# EAGLE design control (EAGLE 6.4)
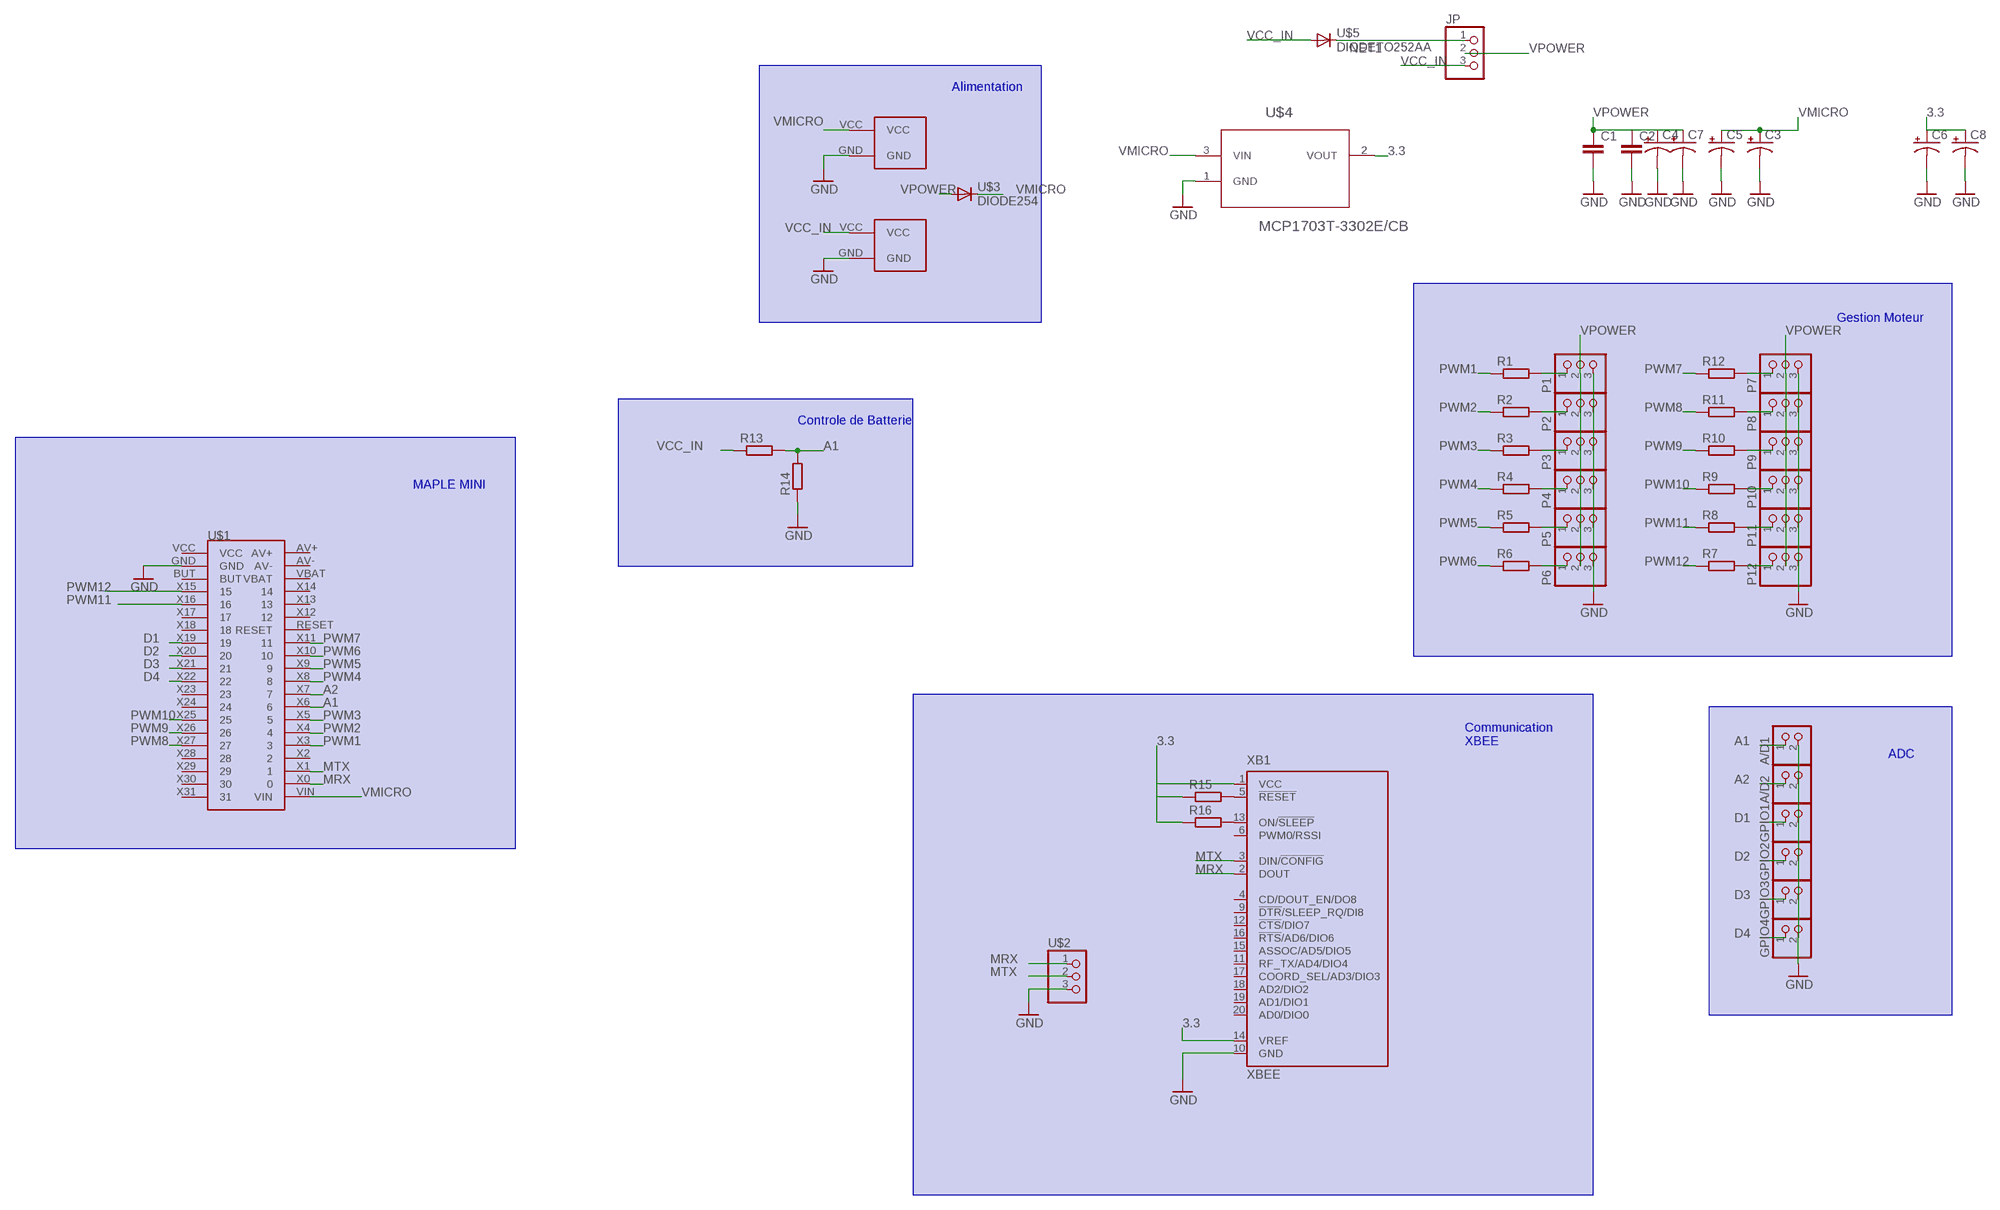
[diagram p0: schematic, sheet 1]

## Parts
A/D1  CONNEC_1X02  [CONNEC_1X02]
A/D2  CONNEC_1X02  [CONNEC_1X02]
C1  C-EU075-032X103  [C075-032X103]
C2  C-EU075-032X103  [C075-032X103]
C3  CAP_POLPTH2  [CPOL-RADIAL-10UF-25V]
C4  CAP_POLPTH2  [CPOL-RADIAL-10UF-25V]
C5  CAP_POLPTH2  [CPOL-RADIAL-10UF-25V]
C6  CAP_POLPTH2  [CPOL-RADIAL-10UF-25V]
C7  CAP_POLPTH2  [CPOL-RADIAL-10UF-25V]
C8  CAP_POLPTH2  [CPOL-RADIAL-10UF-25V]
GPIO1  CONNEC_1X02  [CONNEC_1X02]
GPIO2  CONNEC_1X02  [CONNEC_1X02]
GPIO3  CONNEC_1X02  [CONNEC_1X02]
GPIO4  CONNEC_1X02  [CONNEC_1X02]
JP  CONNEC_1X03  [CONNEC_1X03]
P1  CONNEC_1X03  [CONNEC_1X03]
P2  CONNEC_1X03  [CONNEC_1X03]
P3  CONNEC_1X03  [CONNEC_1X03]
P4  CONNEC_1X03  [CONNEC_1X03]
P5  CONNEC_1X03  [CONNEC_1X03]
P6  CONNEC_1X03  [CONNEC_1X03]
P7  CONNEC_1X03  [CONNEC_1X03]
P8  CONNEC_1X03  [CONNEC_1X03]
P9  CONNEC_1X03  [CONNEC_1X03]
P10  CONNEC_1X03  [CONNEC_1X03]
P11  CONNEC_1X03  [CONNEC_1X03]
P12  CONNEC_1X03  [CONNEC_1X03]
R1  RESISTANCE-R0805  [R0805]
R2  RESISTANCE-R0805  [R0805]
R3  RESISTANCE-R0805  [R0805]
R4  RESISTANCE-R0805  [R0805]
R5  RESISTANCE-R0805  [R0805]
R6  RESISTANCE-R0805  [R0805]
R7  RESISTANCE-R0805  [R0805]
R8  RESISTANCE-R0805  [R0805]
R9  RESISTANCE-R0805  [R0805]
R10  RESISTANCE-R0805  [R0805]
R11  RESISTANCE-R0805  [R0805]
R12  RESISTANCE-R0805  [R0805]
R13  R-EU_R0805  [R0805]
R14  R-EU_R0805  [R0805]
R15  R-EU_R0805  [R0805]
R16  R-EU_R0805  [R0805]
U$1  MAPLE_MINI  [CONNEC_2X20]
U$2  CONNEC_1X03  [CONNEC_1X03]
U$3  DIODE254  [DIODE_254]
U$4  MCP1703T-3302E/CB  [SOT95P300X145-3N]
U$5  DIODETO252AA  [TO-252AA]
U$10  JST_2  [JST_2]
U$11  JST_2  [JST_2]
XB1  XBEE  [XBEE]

## Nets
3.3: C6.1(+) C8.1(+) R15.1 R16.1 U$4.2(VOUT) XB1.1(VCC) XB1.14(VREF)
A1: A/D1.1 R13.2 R14.2 U$1.X6
A2: A/D2.1 U$1.X7
D1: GPIO1.1 U$1.X19
D2: GPIO2.1 U$1.X20
D3: GPIO3.1 U$1.X21
D4: GPIO4.1 U$1.X22
GND [alime]: A/D1.2 A/D2.2 C1.2 C2.2 C3.2(-) C4.2(-) C5.2(-) C6.2(-) C7.2(-) C8.2(-) GPIO1.2 GPIO2.2 GPIO3.2 GPIO4.2 P1.3 P2.3 P3.3 P4.3 P5.3 P6.3 P7.3 P8.3 P9.3 P10.3 P11.3 P12.3 R14.1 U$1.GND U$2.3 U$4.1(GND) U$10.GND U$11.GND XB1.10(GND)
MRX: U$1.X0 U$2.1 XB1.2(DOUT)
MTX: U$1.X1 U$2.2 XB1.3(DIN/!CONFIG)
N$1: P1.1 R1.2
N$2: P2.1 R2.2
N$3: P3.1 R3.2
N$4: P4.1 R4.2
N$5: P5.1 R5.2
N$6: P6.1 R6.2
N$7: P12.1 R7.2
N$8: P11.1 R8.2
N$9: P10.1 R9.2
N$10: P9.1 R10.2
N$11: P8.1 R11.2
N$12: P7.1 R12.2
N$13: R15.2 XB1.5(!RESET)
N$15: R16.2 XB1.13(ON/!SLEEP)
NET1: JP.1 U$5.4(C)
PWM1: R1.1 U$1.X3
PWM2: R2.1 U$1.X4
PWM3: R3.1 U$1.X5
PWM4: R4.1 U$1.X8
PWM5: R5.1 U$1.X9
PWM6: R6.1 U$1.X10
PWM7: R12.1 U$1.X11
PWM8: R11.1 U$1.X27
PWM9: R10.1 U$1.X26
PWM10: R9.1 U$1.X25
PWM11: R8.1 U$1.X16
PWM12: R7.1 U$1.X15
VCC_IN [alime]: JP.3 R13.1 U$5.3(A) U$11.VCC
VMICRO [alime]: C3.1(+) C5.1(+) U$1.VIN U$3.B(C) U$4.3(VIN) U$10.VCC
VPOWER [alime]: C1.1 C2.1 C4.1(+) C7.1(+) JP.2 P1.2 P2.2 P3.2 P4.2 P5.2 P6.2 P7.2 P8.2 P9.2 P10.2 P11.2 P12.2 U$3.A
Unconnected: U$1.AV+ U$1.AV- U$1.BUT U$1.RESET U$1.VBAT U$1.VCC U$1.X2 U$1.X12 U$1.X13 U$1.X14 U$1.X17 U$1.X18 U$1.X23 U$1.X24 U$1.X28 U$1.X29 U$1.X30 U$1.X31 XB1.4(CD/DOUT_EN/DO8) XB1.6(PWM0/RSSI) XB1.9(!DTR!/SLEEP_RQ/DI8) XB1.11(RF_TX/AD4/DIO4) XB1.12(!CTS!/DIO7) XB1.15(ASSOC/AD5/DIO5) XB1.16(!RTS!/AD6/DIO6) XB1.17(COORD_SEL/AD3/DIO3) XB1.18(AD2/DIO2) XB1.19(AD1/DIO1) XB1.20(AD0/DIO0)

## Notes on the sheet
- Alimentation
- Gestion Moteur
- Controle de Batterie
- MAPLE MINI
- Communication
  XBEE
- ADC

## Library data of the parts
A/D1 A/D2 GPIO1-GPIO4 = rhoban:CONNEC_1X02
C1 C2 = rcl:C-EU: CAPACITOR, European symbol
C3-C8 = SparkFun-Capacitors:CAP_POL: Capacitor Polarized These are standard SMD and PTH capacitors. Normally 10uF, 47uF, and 100uF in electrolytic and tantalum varieties. Always verify the external diameter of the through hole cap, it varies with capacity, voltage, and manufacturer. The EIA devices should be standard.
JP U$2 = RobotCampus:CONNEC_1X03
P1-P12 = rhoban:CONNEC_1X03
R1-R12 = rhoban:RESISTANCE: RESISTOR, European symbol
R13-R16 = rcl:R-EU_: RESISTOR, European symbol
U$1 = rhoban:MAPLE_MINI
U$3 = RobotCampus:DIODE254
U$4 = RobotCampus:MCP1703T-3302E/CB: Low Quiescent Current LDO Regulator; MPN: MCP1703T-3302E/CB; OC_FARNELL: 1439518; OC_NEWARK: 40M0637; PACKAGE: SOT-3; SUPPLIER: Microchip
U$5 = RobotCampus:DIODE
U$10 U$11 = RobotCampus:JST_2
XB1 = RobotCampus:XBEE: XBee (TM) /XBee-PRO(TM) OEM RF Modules Source: MaxStream, Inc. xbee_productmanual.pdf; MPN: XBP24-Z7UIT-004; OC_FARNELL: 1751799; OC_NEWARK: 34R5507

## Net classes
1 alime: width 1.016 mm

## Board
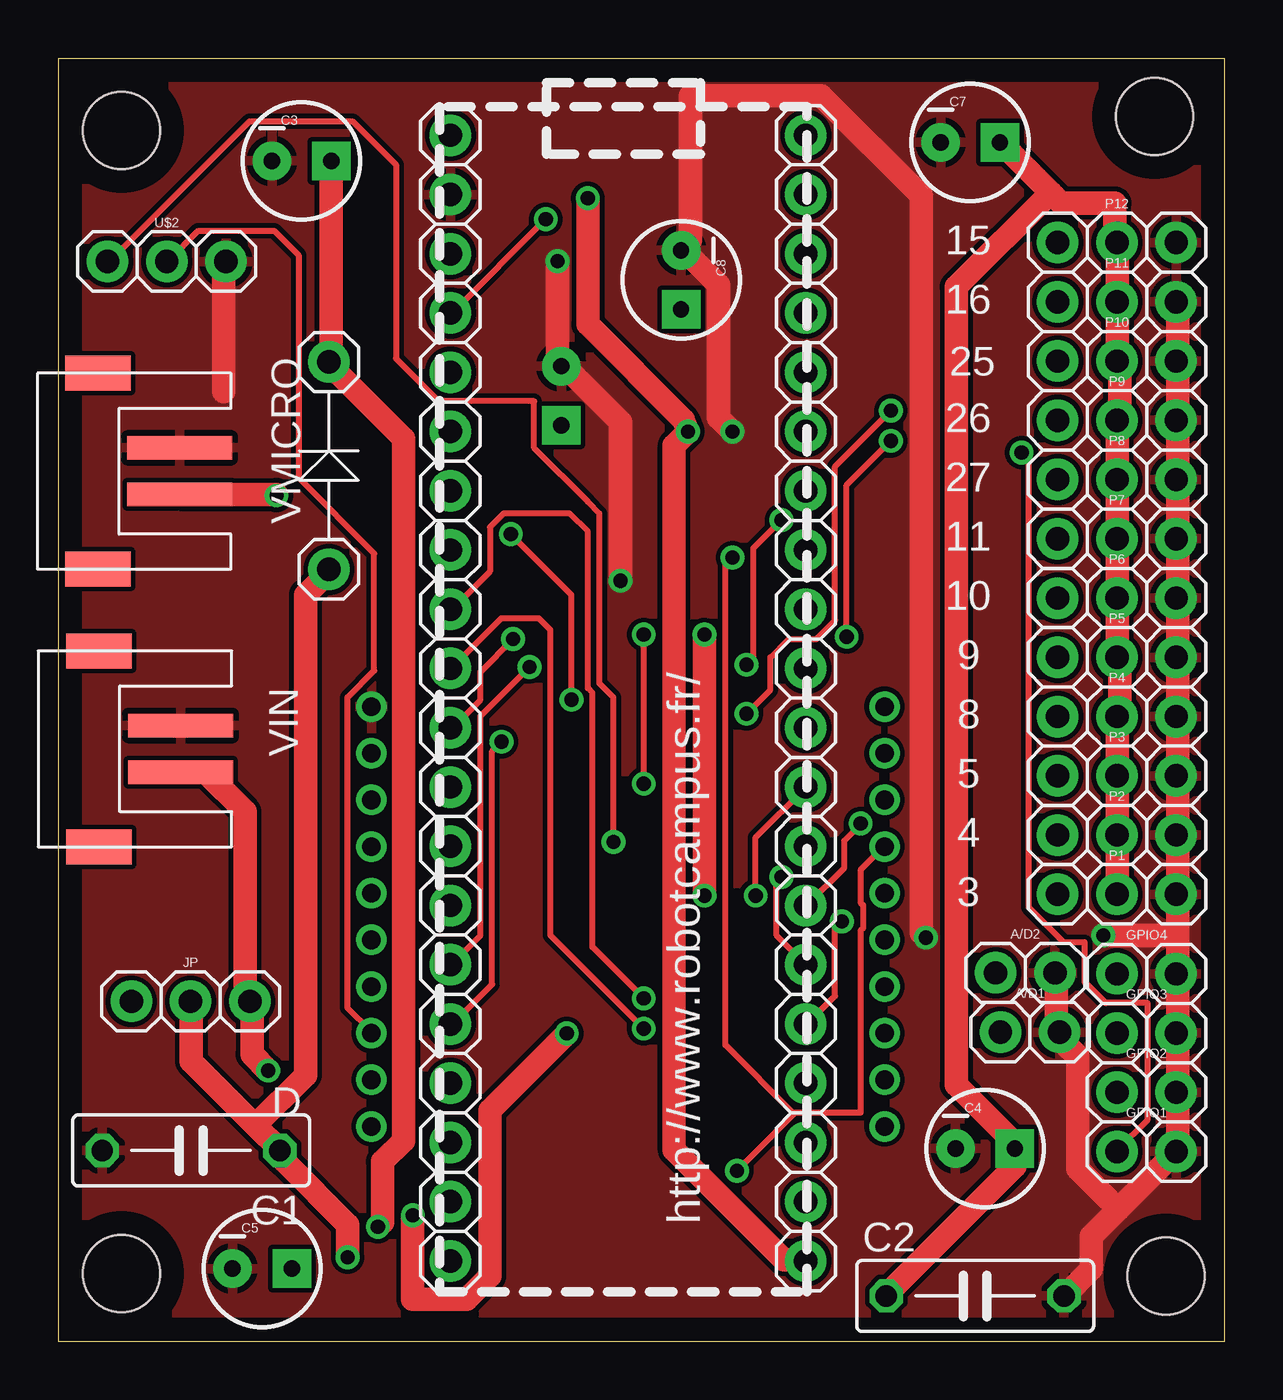
[diagram p1: board, top side]
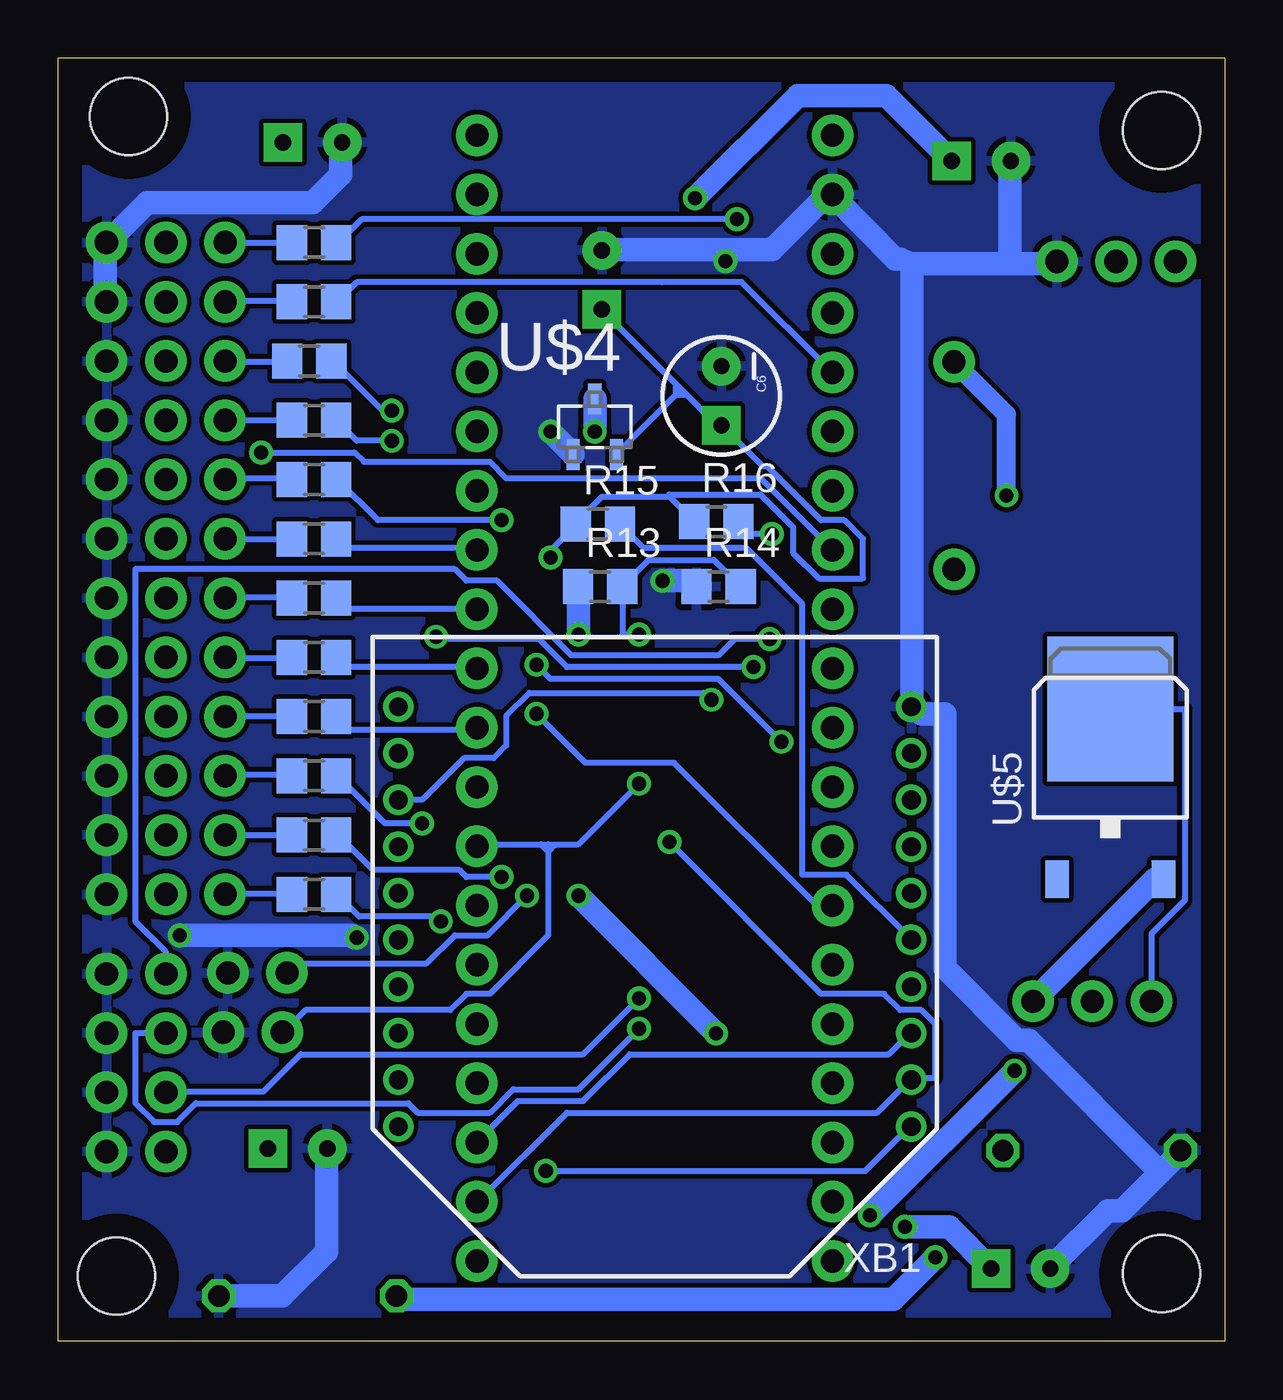
[diagram p2: board, bottom side, seen from below]

Size 50 x 55 mm. Coordinates in mm from the lower left corner, seen from the top.
Outline: 0,0 50,0 50,55 0,55 0,0
Copper layers (1*16): Top 0.035mm / dielectric 1.5mm / Bottom 0.035mm
Design rules "default *": minimum track width 10mil, minimum drill 24mil, track to track 8mil, track to pad 8mil, pad to pad 8mil, via to via 8mil, smd to smd 8mil, copper to edge 40mil, drill to drill 8mil, minimum pad ring 10mil, minimum via ring 8mil, stop-mask expansion 4mil, vias tented up to drill 0mil, thermal gap 10mil

### Footprints (pad centres in the part's own frame; a part is rotated, then mirrored left to right if it is on the bottom)
CONNEC_1X02 = drill 1 pad 1.778: 1 -1.27,1.27; 2 1.27,1.27
C075-032X103 = drill 0.914 octagon: 1 -3.81,0; 2 3.81,0
CPOL-RADIAL-10UF-25V = drill 0.7 pad 1.651 square: 1 1.27,0 | drill 0.7 pad 1.651: 2 -1.27,0
CONNEC_1X03 = drill 1 pad 1.778: 1 -1.27,1.27; 2 1.27,1.27; 3 3.81,1.27
R0805 = smd 1.3 x 1.5: 1 -0.95,0; 2 0.95,0
CONNEC_2X20 = drill 1 pad 1.778: AV+ 0,0; AV- 2.54,0; BUT 5.08,-15.24; GND 2.54,-15.24; RESET 15.24,0; VBAT 5.08,0; VCC 0,-15.24; VIN 48.26,0; X0 45.72,0; X1 43.18,0; X2 40.64,0; X3 38.1,0; X4 35.56,0; X5 33.02,0; X6 30.48,0; X7 27.94,0; X8 25.4,0; X9 22.86,0; X10 20.32,0; X11 17.78,0; X12 12.7,0; X13 10.16,0; X14 7.62,0; X15 7.62,-15.24; X16 10.16,-15.24; X17 12.7,-15.24; X18 15.24,-15.24; X19 17.78,-15.24; X20 20.32,-15.24; X21 22.86,-15.24; X22 25.4,-15.24; X23 27.94,-15.24; X24 30.48,-15.24; X25 33.02,-15.24; X26 35.56,-15.24; X27 38.1,-15.24; X28 40.64,-15.24; X29 43.18,-15.24; X30 45.72,-15.24; X31 48.26,-15.24
DIODE_254 = drill 1 pad 1.778: A 0,0; B 8.89,0
SOT95P300X145-3N = smd 0.559 x 1.321: 1 -0.94,-1.194; 2 0.94,-1.194; 3 0,1.194
TO-252AA = smd 1 x 1.6: 1 -2.28,-4.8; 3 2.28,-4.8 | smd 5.4 x 6.2: 4 0,2.5
STAND-OFF = hole 3.302: 0,0
JST_2 = smd 4.5 x 1: GND -2,-1; VCC -2,1 | smd 2.8 x 1.5: P$1 1.5,4.2; P$2 1.5,-4.2
XBEE = drill 0.8 pad 1.27: 1 -11,9; 2 -11,7; 3 -11,5; 4 -11,3; 5 -11,1; 6 -11,-1; 7 -11,-3; 8 -11,-5; 9 -11,-7; 10 -11,-9; 11 11,-9; 12 11,-7; 13 11,-5; 14 11,-3; 15 11,-1; 16 11,1; 17 11,3; 18 11,5; 19 11,7; 20 11,9

### Placement (x,y rotation side)
A/D1  41.66,11.98 0 top
A/D2  41.46,14.52 0 top
C1  5.69,8.18 180 top
C2  39.31,1.94 0 top
C3  10.43,50.6 0 top
C4  39.74,8.26 0 top
C5  8.74,3.11 0 top
C6  21.57,40.53 270 bottom
C7  39.1,51.4 0 top
C8  26.7,45.5 270 top
GPIO1  46.66,6.86 0 top
GPIO2  46.66,9.4 0 top
GPIO3  46.66,11.94 0 top
GPIO4  46.66,14.48 0 top
JP  4.4,13.3 0 top
P1  44.12,17.89 0 top
P2  44.12,20.43 0 top
P3  44.12,22.97 0 top
P4  44.12,25.51 0 top
P5  44.12,28.05 0 top
P6  44.12,30.59 0 top
P7  44.12,33.13 0 top
P8  44.12,35.67 0 top
P9  44.12,38.21 0 top
P10  44.12,40.75 0 top
P11  44.12,43.29 0 top
P12  44.12,45.83 0 top
R1  39.04,19.16 180 bottom
R2  39.04,21.7 180 bottom
R3  39.04,24.24 180 bottom
R4  39.04,26.78 180 bottom
R5  39.04,29.32 180 bottom
R6  39.04,31.86 180 bottom
R7  39.04,47.1 180 bottom
R8  39.04,44.56 180 bottom
R9  39.24,42.02 180 bottom
R10  39.04,39.48 180 bottom
R11  39.04,36.94 180 bottom
R12  39.04,34.4 180 bottom
R13  26.77,32.35 0 bottom
R14  21.69,32.35 0 bottom
R15  26.87,35.03 0 bottom
R16  21.79,35.13 0 bottom
U$1  32.05,51.7 270 top
U$2  3.38,45.02 0 top
U$3  11.6,33.09 90 top
U$4  27,39.2 0 bottom
U$5  4.9,24.6 0 bottom
U$6  [STAND-OFF]  2.7,2.9 0 top
U$7  [STAND-OFF]  47.5,2.8 0 top
U$8  [STAND-OFF]  47,52.5 0 top
U$9  [STAND-OFF]  2.7,51.9 0 top
U$10  3.2,37.3 180 top
U$11  3.24,25.39 180 top
XB1  24.43,18.21 180 bottom

### Tracks (layer width: path | path; a pad name or v marks a point on that pad's centre or on a via)
3.3  (via drill 0.61)
  Top 0.254: 31.55,9.75 31.6,9.8 34.4,9.8 34.4,17.6 34.5,17.7 34.5,18.7 34.4,18.8 34.4,20.2 35.4,21.2 XB1.14 | 31.55,9.75 v29.1,7.3 | v28.9,33.6 28.6,33.3 28.6,12.7 31.55,9.75
  Bottom 0.254: U$4.2 26,38.1 23.31,40.79 23.29,40.79 | 21.6,39.2 C6.1 | 23.29,40.79 21.8,39.3 C6.1 | 23.29,40.79 26.7,44.2 C8.1 | 23.8,36.2 22.8,35.2 R16.1 | 23.8,36.2 26.7,36.2 27.8,35.1 R15.1 | 27.8,34.9 R15.1 | v29.1,7.3 15.4,7.3 13.5,9.2 13.4,9.2 XB1.1 | 28.9,33.95 v28.9,33.6 28.8,34 27.9,34.9 R15.1 | C6.1 21.5,39.2 19.8,37.5 19.6,37.5 17.3,35.2 16.3,35.2 15.5,34.4 15.5,32.7 17.4,32.7 18.5,33.8 18.5,34.9 19.9,36.3 23.8,36.3 23.8,36.2
A1  (via drill 0.61)
  Top 0.254: v25.1,23.9 v25.1,30.3
  Bottom 0.254: R14.2 20.8,32.4 21.9,33.5 24.7,33.5 25.8,32.4 R13.2 25.8,32.3 25.8,30.3 v25.1,30.3 | v25.1,23.9 27.7,21.3 29,21.3 | 29,21.3 32,21.3 U$1.X6 | 29,21.3 29,17.4 31.5,14.9 32.5,14.9 33.2,14.2 39.4,14.2 40.3,13.3 A/D1.1
A2  (via drill 0.61)
  Top 0.254: v29.9,19.1 29.9,21.6 32,23.7 U$1.X7
  Bottom 0.254: v29.9,19.1 31.6,17.4 33,17.4 34.2,16.2 39.7,16.2 40.1,15.8 A/D2.1
D1  (via drill 0.61)
  Top 0.254: v41.3,38.1 41.6,37.8 41.6,18.6 43.1,17.1 44,17.1 44,15.4 44.9,14.5 46.7,14.5 46.7,9.5 45.4,8.2 GPIO1.1
  Bottom 0.254: v41.3,38.1 37.3,38.1 36.9,37.7 31.5,37.7 30.8,37 19.9,37 16.9,34 U$1.X19
D2  (via drill 0.61)
  Top 0.254: v25.1,14.7 22.9,16.9 22.9,27.8 22.7,28 22.7,34.71 21.91,35.5 19.1,35.5 18.5,34.9 18.5,33 16.9,31.4 U$1.X20
  Bottom 0.254: v25.1,14.7 27.5,12.3 39.6,12.3 41.2,10.7 45.3,10.7 GPIO2.1
D3  (via drill 0.61)
  Top 0.254: v25.1,13.4 21.1,17.4 21.1,30.49 20.59,31 19,31 16.9,28.9 U$1.X21
  Bottom 0.254: v25.1,13.4 27.7,10.8 30.5,10.8 31.5,9.8 34.6,9.8 35,10.2 44.1,10.2 44.9,9.4 45.9,9.4 46.7,10.2 46.7,13.2 GPIO3.1
D4  (via drill 0.61)
  Top 0.254: v19.5,30.1 18.1,28.7 18.1,27.5 16.9,26.3 U$1.X22
  Bottom 0.254: v19.5,30.1 21,30.1 21.7,29.4 28,29.4 31.2,32.6 32.5,32.6 33,33.1 46.7,33.1 46.7,18 45.4,16.7 45.4,15.8 GPIO4.1
GND  (via drill 0.61)
  Top 1.016: A/D2.2 42.8,15.7 42.8,13.4 42.9,13.3 A/D1.2 43.1,12.8 43.7,12.2 43.7,7.4 45.45,5.65 | 45.45,5.65 GPIO1.2 48,8.6 48,10.6 GPIO2.2 48,11.1 48,13.2 GPIO3.2 48,13.7 48,15.7 GPIO4.2 48,16.2 48,17.4 | 45.45,5.65 44.3,4.5 44.3,3.1 43.2,2 C2.2 | P11.3 48,44.5 48,42.5 P10.3 48,42 48,39.9 P9.3 48,39.4 48,37.4 P8.3 48,36.9 48,34.9 P7.3 48,34.4 48,32.3 P6.3 48,31.8 48,29.8 P5.3 48,29.3 48,27.2 P4.3 48,26.7 48,24.7 P3.3 48,24.2 48,22.2 P2.3 48,21.7 48,19.2 P1.3 48,18.7 48,17.4 | v24.1,32.6 24.1,39.4 21.7,41.8 C6.2 21.4,42.3 v21.4,46.3 | v28.9,39 28.3,39.6 28.3,45.3 26.9,46.7 26.7,46.7 C8.2 27.1,47.2 27.1,53.4 32.7,53.4 37,49.1 37,17.5 v37.2,17.3 | 7.1,40.7 7.1,46.2 U$2.3 | v44.8,17.4 48,17.4
  Bottom 1.016: C4.2 38.5,8.2 38.5,3.83 40.4,1.94 C2.2 43.1,2 | C7.2 37.9,51.4 37.9,50 39.1,48.81 46.19,48.81 47.9,47.1 P12.3 48,46.6 48,44.6 P11.3 | 2.75,7.25 4.4,5.6 5,5.6 7.4,3.2 C5.2 | 2.75,7.25 1.9,8.1 C1.2 | v24.1,32.6 22.9,32.6 22.7,32.4 R14.1 | v28.9,39 28,38.1 U$4.1 | 13.4,46.2 13.4,27.3 XB1.10 13,26.9 12,26.9 12,16 8.9,12.9 8.4,12.9 2.75,7.25 | 9.2,46.2 7.2,46.2 U$2.3 | 9.2,46.2 13.4,46.2 | 9.2,46.2 9.2,50.6 C3.2 | 13.4,46.2 13.9,46.4 14.1,46.4 16.8,49.1 U$1.GND 17.3,48.9 19.4,46.8 21.4,46.8 | 21.4,46.8 26.7,46.8 C8.2 | v21.4,46.3 21.4,46.8 | v44.8,17.4 37.4,17.4 37.3,17.3 v37.2,17.3
  pour Top: -7.54,75.65 64.01,75.65 64.01,-11.88 -9.97,-11.88 -9.97,70.37
  pour Bottom: -25.57,57.23 82.36,57.23 82.36,-2.51 -27.13,-2.51 -27.13,52.66
MRX  (via drill 0.61)
  Top 0.254: v23.8,21.4 23.8,27.6 23.2,28.2 23.2,35.49 22.7,35.99 22.7,36 20.4,38.3 20.4,40.3 16.3,40.3 14.47,42.13 14.47,50.44 12.62,52.3 8.2,52.3 2.2,46.3 U$2.1
  Bottom 0.254: U$1.X0 32,6 28.2,9.8 14.9,9.8 13.5,11.2 XB1.2 13.4,11.3 12.4,11.3 12.4,13.6 13,14.2 13.9,14.2 14.6,14.9 17.3,14.9 v23.8,21.4
MTX
  Top 0.254: U$2.2 4.7,46.3 6,47.6 9.26,47.6 10.29,46.57 10.29,37.02 13.55,33.76 13.55,28.75 12.4,27.6 12.4,14.3 13.4,13.3 XB1.3
  Bottom 0.254: XB1.3 13.5,13.2 14.4,12.3 25.5,12.3 27.5,10.3 30.3,10.3 32,8.6 U$1.X1
N$1
  Bottom 0.254: R1.2 40,19.2 42.8,19.2 P1.1
N$2
  Bottom 0.254: P2.1 R2.2
N$3
  Bottom 0.254: R3.2 40,24.3 42.8,24.3 P3.1
N$4
  Bottom 0.254: R4.2 40,26.8 42.8,26.8 P4.1
N$5
  Bottom 0.254: R5.2 40,29.3 42.8,29.3 P5.1
N$6
  Bottom 0.254: R6.2 40,31.9 42.8,31.9 P6.1
N$7
  Bottom 0.254: P12.1 R7.2
N$8
  Bottom 0.254: R8.2 40,44.6 42.8,44.6 P11.1
N$9
  Bottom 0.254: R9.2 40.2,42 42.8,42 P10.1
N$10
  Bottom 0.254: R10.2 40,39.5 42.8,39.5 P9.1
N$11
  Bottom 0.254: R11.2 40,37 42.8,37 P8.1
N$12
  Bottom 0.254: P7.1 R12.2
N$13
  Bottom 0.254: R15.2 25.9,35 24.9,34 20.5,34 18.1,31.6 18.1,20 16.2,20 13.5,17.3 XB1.5
N$14
  Bottom 0.254: 23.5,40.57 23.1,40.57
N$15  (via drill 0.61)
  Top 0.254: v19.4,34.6 22,32 v22,27.5
  Bottom 0.254: v19.4,34.6 20.3,34.6 20.8,35.1 R16.2 | v22,27.5 22.3,27.8 29.8,27.8 30.8,26.8 30.8,25.53 31.33,25 32.6,25 34.39,23.21 XB1.13
N$16
  Bottom 0.254: 23.52,40.59 23.52,40.98
N$17
  Bottom 0.254: 28.7,21.27 29,20.96
N$18
  Bottom 0.254: 29.02,21.02 29.3,21.3 29.32,21.3
NET1
  Bottom 0.254: U$5.4 1.7,27.1 1.7,18.9 3.13,17.47 JP.1 3.1,14.6
PWM1  (via drill 0.61)
  Top 0.254: v33.6,18 33.3,17.7 33.3,14.8 32.1,13.6 U$1.X3
  Bottom 0.254: v33.6,18 33.8,18.2 37.1,18.2 38,19.1 R1.1
PWM2  (via drill 0.61)
  Top 0.254: v31,19.9 30.8,19.7 30.8,17.4 32,16.2 U$1.X4
  Bottom 0.254: v31,19.9 32.5,19.9 32.8,20.2 36.5,20.2 38,21.7 R2.1
PWM3  (via drill 0.61)
  Top 0.254: U$1.X5 32.1,18.7 33.69,20.29 33.69,21.46 34.4,22.17 v34.4,22.2
  Bottom 0.254: v34.4,22.2 36,22.2 38,24.2 R3.1
PWM4
  Bottom 0.254: R4.1 38,26.7 37.5,26.2 32.2,26.2 32.1,26.3 U$1.X8
PWM5
  Bottom 0.254: R5.1 38,29.3 37.6,28.9 32.1,28.9 U$1.X9
PWM6
  Bottom 0.254: R6.1 38,31.8 37.6,31.4 32.1,31.4 U$1.X10
PWM7
  Bottom 0.254: R12.1 38,34.4 37.6,34 32.1,34 U$1.X11
PWM8  (via drill 0.61)
  Top 0.254: v31,35.2 29.8,34 29.8,29.3 v29.5,29 | v19,25.7 18.6,25.3 18.6,15.3 16.9,13.6 U$1.X27
  Bottom 0.254: v31,35.2 36.3,35.2 38,36.9 R11.1 | v29.5,29 28.9,28.4 21.7,28.4 v19,25.7
PWM9  (via drill 0.61)
  Top 0.254: v35.7,38.6 33.8,36.7 v33.8,30.2 | v20.2,28.9 18.1,26.8 18.1,17.4 16.9,16.2 U$1.X26
  Bottom 0.254: v35.7,38.6 37.2,38.6 38,39.4 R10.1 | v33.8,30.2 33.7,30.1 29.4,30.1 28.2,28.9 v20.2,28.9
PWM10  (via drill 0.61)
  Top 0.254: v35.7,39.9 33.3,37.5 33.3,30.9 32.5,30.1 31.31,30.1 30.53,29.32 30.53,27.93 v29.5,26.9
  Bottom 0.254: v35.7,39.9 36.1,39.9 38.2,42 R9.1 | v29.5,26.9 27.4,24.8 23.6,24.8 17.5,18.7 16.9,18.7 U$1.X25
PWM11
  Bottom 0.254: R8.1 38,44.6 37.2,45.4 24.1,45.4 24.09,45.41 20.71,45.41 16.9,41.6 U$1.X16
PWM12  (via drill 0.61)
  Top 0.254: v20.9,48.1 16.9,44.1 U$1.X15
  Bottom 0.254: R7.1 38,47.1 37,48.1 v20.9,48.1
VCC_IN  (via drill 0.61)
  Top 0.813: U$11.VCC 6.31,24.39
  Top 1.016: v27.7,19.1 v27.7,30.3 | v21.8,13.2 18.5,9.9 18.5,2.8 17.5,1.8 15.2,1.8 v15.2,5.4 | v9,11.6 8.3,12.3 8.3,14.5 JP.3 8,15 8,22.7 6.31,24.39
  Bottom 1.016: v27.7,30.3 27.7,32.3 R13.1 | v21.8,13.2 v27.7,19.1 | v9,11.6 v15.2,5.4 | U$5.3 2.98,19.8 JP.3
VMICRO  (via drill 0.6, 0.61)
  Top 1.016: U$1.VIN 32,3.5 31.1,3.5 26.4,8.2 26.4,38.4 v27,39 26.8,39.5 22.7,43.6 v22.7,49 | v13.7,4.9 13.9,5.1 13.9,7.7 14.8,8.6 14.8,38.7 11.6,41.9 U$3.B 11.7,42.4 C3.1 | U$10.VCC 9.35,36.3 v9.35,36.25
  Bottom 0.813: v9.35,36.25 9.35,39.73 U$3.B
  Bottom 1.016: v27,39 U$4.3 | C5.1 11.8,4.9 v13.7,4.9 | v22.7,49 18.3,53.4 14.5,53.4 C3.1
VPOWER  (via drill 0.61)
  Top 1.016: 8.45,9.25 5.7,12 5.7,14.5 JP.2 | 8.45,9.25 9.5,8.2 C1.1 9.7,7.7 12.4,5 v12.4,3.6 | 8.45,9.25 10.6,11.4 10.6,32 11.6,33 U$3.A | P1.2 45.4,19.2 P2.2 45.4,22.2 45.4,24.2 P3.2 45.4,24.7 45.4,26.7 P4.2 45.5,27.3 45.5,29.2 45.4,29.3 P5.2 45.4,29.8 45.4,31.8 P6.2 45.4,32.3 P7.2 45.4,34.9 45.4,36.9 P8.2 45.4,37.4 45.4,39.4 P9.2 45.5,40 45.5,41.9 45.4,42 P10.2 45.4,42.5 45.4,44.1 P11.2 45.4,44.6 45.4,46.6 P12.2 45.3,47.1 45.3,48.8 43,48.8 42.55,49.25 | C2.1 35.5,2 41,7.5 41,8.2 C4.1 40.8,8.7 38.5,11 38.5,45.2 42.55,49.25 | 42.55,49.25 40.4,51.4 C7.1
  Bottom 1.016: v12.4,3.6 14.2,1.8 35.4,1.8 35.5,1.9 C2.1

### Text on the board
_tsilk: 15 | 16 | 25 | 26 | 27 | VMICRO | 11 | 10 | 9 | 8 | VIN | 5 | 4 | 3 | D | http://www.robotcampus.fr/
200bmp: /tmp/robotcampus.bmp